# EAGLE schematic untitled (EAGLE 9.0.1)
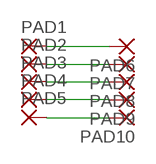
[diagram p0: schematic, sheet 1]

## Parts
PAD1  2,15/1,0  [2,15/1,0]
PAD2  2,15/1,0  [2,15/1,0]
PAD3  2,15/1,0  [2,15/1,0]
PAD4  2,15/1,0  [2,15/1,0]
PAD5  2,15/1,0  [2,15/1,0]
PAD6  2,15/1,0  [2,15/1,0]
PAD7  2,15/1,0  [2,15/1,0]
PAD8  2,15/1,0  [2,15/1,0]
PAD9  2,15/1,0  [2,15/1,0]
PAD10  2,15/1,0  [2,15/1,0]

## Nets
N$1: PAD1.1(P) PAD6.1(P)
N$2: PAD2.1(P) PAD7.1(P)
N$3: PAD3.1(P) PAD8.1(P)
N$4: PAD4.1(P) PAD9.1(P)
N$5: PAD5.1(P) PAD10.1(P)

## Library data of the parts
PAD1-PAD10 = wirepad:2,15/1,0: THROUGH-HOLE PAD